# Altium schematic sheet MiniSTM32_2.SchDoc: MIni Device
size A4; DrawnBy: Sean
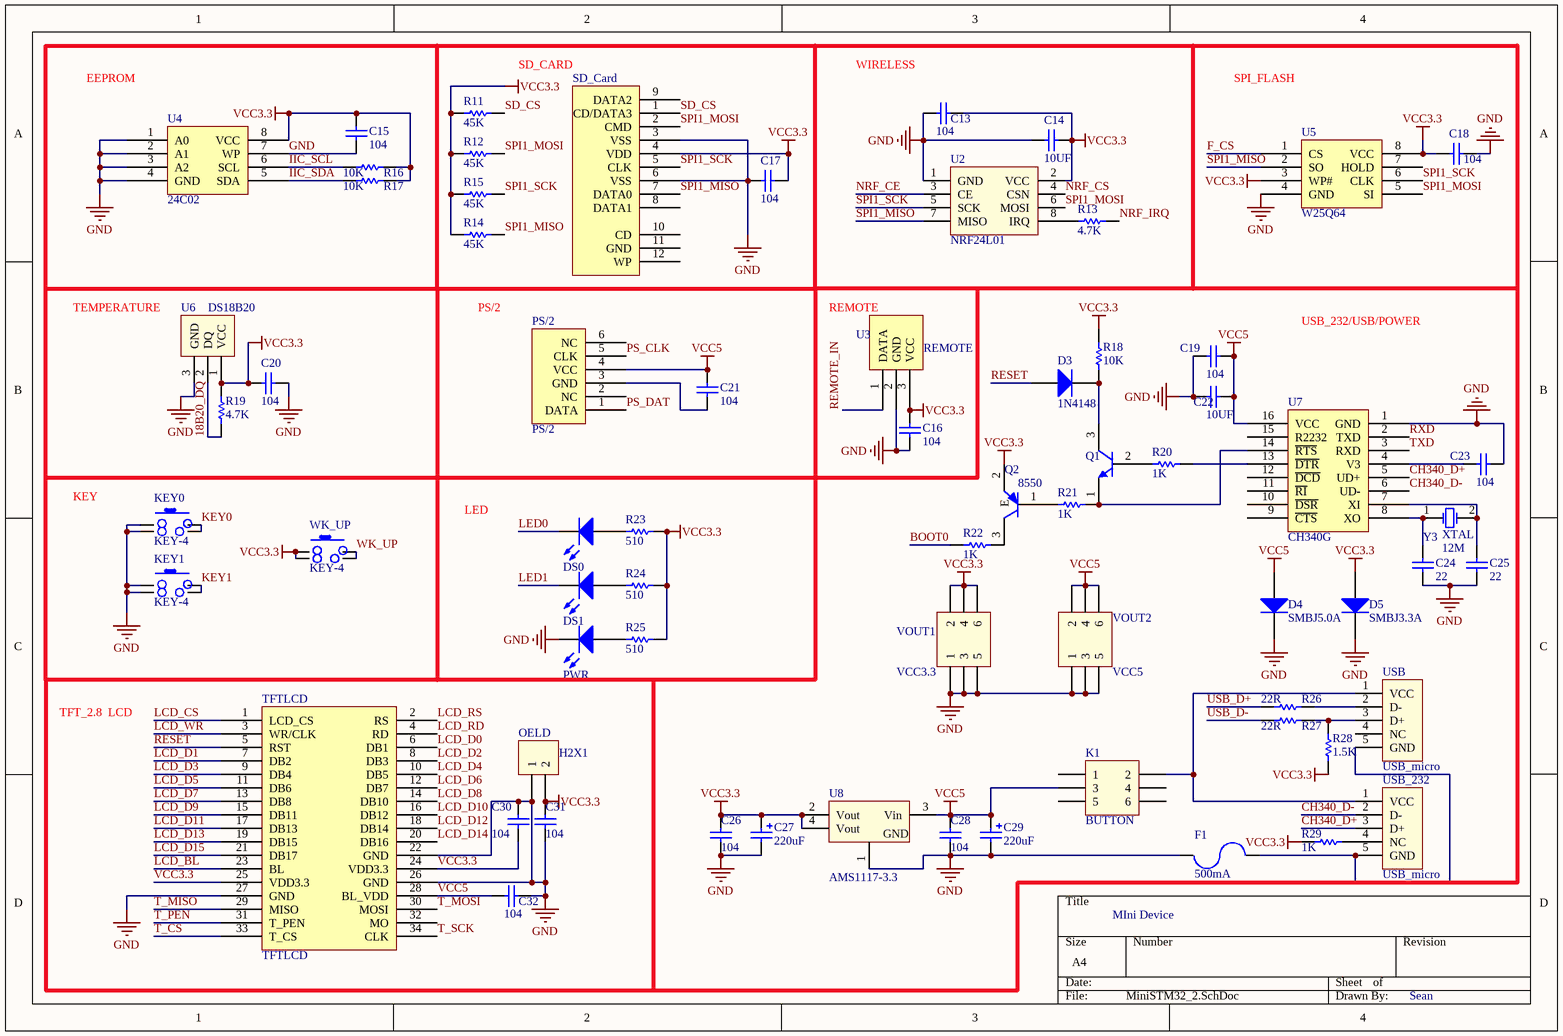
[diagram p0: MiniSTM32_2.SchDoc]

## Parts
C13  Cap  [CAP[0603]]  (value not drawn)
C14  Cap  [CAP[0805]]  (value not drawn)
C15  Cap  [CAP[0603]]  (value not drawn)
C16  Cap  [CAP[0603]]  (value not drawn)
C17  Cap  [CAP[0603]]  (value not drawn)
C18  Cap  [CAP[0603]]  (value not drawn)
C19  Cap  [CAP[0603]]  (value not drawn)
C20  Cap  [CAP[0603]]  (value not drawn)
C21  Cap  [CAP[0603]]  (value not drawn)
C22  Cap  [CAP[1206]]  (value not drawn)
C23  Cap  [CAP[0603]]  (value not drawn)
C24  Cap  [CAP[0805]]  (value not drawn)
C25  Cap  [CAP[0805]]  (value not drawn)
C26  Cap  [CAP[0603]]  (value not drawn)
C27  Cap Pol  [R_6_3_h_7_7]  (value not drawn)
C28  Cap  [CAP[0603]]  (value not drawn)
C29  Cap Pol  [R_6_3_h_7_7]  (value not drawn)
C30  Cap  [CAP[0603]]  (value not drawn)
C31  Cap  [CAP[0603]]  (value not drawn)
C32  Cap  [CAP[0603]]  (value not drawn)
D3  1N4148  [1N4733]
D4  SMBJ5.0A  [1N4733]
D5  SMBJ3.3A  [1N4733]
DS0  LED  [LED[0805]]  (value not drawn)
DS1  LED  [LED[0805]]  (value not drawn)
F1  500mA  [PTC[1206]]
K1  BUTTON  [KEY-6]
KEY0  KEY-4  [KEY-4(DIP)]
KEY1  KEY-4  [KEY-4(DIP)]
OELD  H2X1  [H2.54-1X2(IN)]
PS/2  PS/2  [PS/2]
PWR  LED  [LED[0805]]  (value not drawn)
Q1  9013/8050  [SOT23A]  (value not drawn)
Q2  8550  [SOT23A]
R11  Res  [RES[0603]]  (value not drawn)
R12  Res  [RES[0603]]  (value not drawn)
R13  Res  [RES[0603]]  (value not drawn)
R14  Res  [RES[0603]]  (value not drawn)
R15  Res  [RES[0603]]  (value not drawn)
R16  Res  [RES[0603]]  (value not drawn)
R17  Res  [RES[0603]]  (value not drawn)
R18  Res  [RES[0603]]  (value not drawn)
R19  Res  [RES[0603]]  (value not drawn)
R20  Res  [RES[0603]]  (value not drawn)
R21  Res  [RES[0603]]  (value not drawn)
R22  Res  [RES[0603]]  (value not drawn)
R23  Res  [RES[0603]]  (value not drawn)
R24  Res  [RES[0603]]  (value not drawn)
R25  Res  [RES[0603]]  (value not drawn)
R26  Res  [RES[0603]]  (value not drawn)
R27  Res  [RES[0603]]  (value not drawn)
R28  Res  [RES[0603]]  (value not drawn)
R29  Res  [RES[0603]]  (value not drawn)
SD_Card  SD_Card  [SD_Card]
TFTLCD  TFTLCD  [TFTLCD_2_8]
U2  NRF24L01  [NRF24L01]
U3  REMOTE  [REMOTE]
U4  24C02  [SO-8]
U5  W25Q64  [SO-8]
U6  DS18B20  [H2.54-1X3(RM)]
U7  CH340G  [SO-16]
U8  AMS1117-3.3  [SOT-223(AMS1117-3.3)]
USB  USB_micro  [USB B mini 5pin]
USB_232  USB_micro  [USB B mini 5pin]
VOUT1  VCC3.3  [H2.54-2X3]
VOUT2  VCC5  [H2.54-2X3]
WK_UP  KEY-4  [KEY-4(DIP)]
Y3  XTAL  [XTAL]

## Nets
GND: C13.1 C14.1 C15.1 C16.1 C17.1 C18.2 C19.1 C20.2 C22.1 C23.2 C24.1 C25.1 C26.2 C27.2 C28.2 C29.2 C30.2 C31.1 C32.1 D4.2(K) D5.2(K) F1.1 KEY0.1 KEY0.2 KEY1.1 KEY1.2 OELD.1 PWR.2(K) SD_Card.3(VSS) SD_Card.6(VSS) TFTLCD.22(GND) TFTLCD.26(GND) TFTLCD.27(GND) U2.1(GND) U3.2(GND) U4.1(A0) U4.2(A1) U4.3(A2) U4.4(GND) U4.7(WP) U5.4(GND) U6.3(GND) U7.1(GND) U8.1(GND) VOUT1.1 VOUT1.3 VOUT1.5 VOUT2.1 VOUT2.3 VOUT2.5
VCC3.3: C13.2 C14.2 C15.2 C16.2 C17.2 C18.1 C20.1 C26.1 C27.1 C30.1 C31.2 D5.1(A) OELD.2 Q2.2(E) R11.1 R12.1 R14.1 R15.1 R16.2 R17.2 R18.2 R19.2 R23.2 R24.2 R25.2 R28.1 R29.1 SD_Card.4(VDD) TFTLCD.24(VDD3.3) TFTLCD.25(VDD3.3) U2.2(VCC) U3.3(VCC) U4.8(VCC) U5.3(WP#) U5.8(VCC) U6.1(VCC) U8.2(Vout) U8.4(Vout) VOUT1.2 VOUT1.4 VOUT1.6 WK_UP.1 WK_UP.2
VCC5: C19.2 C21.2 C22.2 C28.1 C29.1 C32.2 D4.1(A) K1.3 PS/2.4(VCC) TFTLCD.28(BL_VDD) U7.16(VCC) U8.3(Vin) VOUT2.2 VOUT2.4 VOUT2.6
18B20_DQ: R19.1 U6.2(DQ)
BOOT0: R22.1
CH340_D+: U7.5(UD+) USB_232.3(D+)
CH340_D-: U7.6(UD-) USB_232.2(D-)
F_CS: U5.1(CS)
IIC_SCL: R16.1 U4.6(SCL)
IIC_SDA: R17.1 U4.5(SDA)
KEY0: KEY0.3 KEY0.4
KEY1: KEY1.3 KEY1.4
LCD_BL: TFTLCD.23(BL)
LCD_CS: TFTLCD.1(LCD_CS)
LCD_D0: TFTLCD.6(DB1)
LCD_D1: TFTLCD.7(DB2)
LCD_D2: TFTLCD.8(DB3)
LCD_D3: TFTLCD.9(DB4)
LCD_D4: TFTLCD.10(DB5)
LCD_D5: TFTLCD.11(DB6)
LCD_D6: TFTLCD.12(DB7)
LCD_D7: TFTLCD.13(DB8)
LCD_D8: TFTLCD.14(DB10)
LCD_D9: TFTLCD.15(DB11)
LCD_D10: TFTLCD.16(DB12)
LCD_D11: TFTLCD.17(DB13)
LCD_D12: TFTLCD.18(DB14)
LCD_D13: TFTLCD.19(DB15)
LCD_D14: TFTLCD.20(DB16)
LCD_D15: TFTLCD.21(DB17)
LCD_RD: TFTLCD.4(RD)
LCD_RS: TFTLCD.2(RS)
LCD_WR: TFTLCD.3(WR/CLK)
LED0: DS0.2(K)
LED1: DS1.2(K)
NRF_CE: U2.3(CE)
NRF_CS: U2.4(CSN)
NRF_IRQ: R13.2
PS_CLK: PS/2.5(CLK)
PS_DAT: PS/2.1(DATA)
REMOTE_IN: U3.1(DATA)
RESET: D3.1 TFTLCD.5(RST)
RXD: U7.2(TXD)
SD_CS: R11.2 SD_Card.1(CD/DATA3)
SPI1_MISO: R14.2 SD_Card.7(DATA0) U2.7(MISO) U5.2(SO)
SPI1_MOSI: R12.2 SD_Card.2(CMD) U2.6(MOSI) U5.5(SI)
SPI1_SCK: R15.2 SD_Card.5(CLK) U2.5(SCK) U5.6(CLK)
T_CS: TFTLCD.33(T_CS)
T_MISO: TFTLCD.29(MISO)
T_MOSI: TFTLCD.30(MOSI)
T_PEN: TFTLCD.31(T_PEN)
T_SCK: TFTLCD.34(CLK)
TXD: U7.3(RXD)
USB_D+: R26.1
USB_D-: R27.1
WK_UP: WK_UP.3 WK_UP.4
NetC21_1: C21.1 PS/2.3(GND)
NetC23_1: C23.1 U7.4(V3)
NetC24_2: C24.2 U7.8(XO) Y3.1(OSC1)
NetC25_2: C25.2 U7.7(XI) Y3.2(OSC2)
NetD3_2: D3.2 Q1.3(C) R18.1
NetDS0_1: DS0.1(A) R23.1
NetDS1_1: DS1.1(A) R24.1
NetF1_2: F1.2 USB.5(GND) USB_232.5(GND)
NetK1_2: K1.2 USB.1(VCC) USB_232.1(VCC)
NetPWR_1: PWR.1(A) R25.1
NetQ1_1: Q1.1(E) R21.2 U7.14(~{RTS})
NetQ1_2: Q1.2(B) R20.1
NetQ2_1: Q2.1(B) R21.1
NetQ2_3: Q2.3(C) R22.2
NetR13_1: R13.1 U2.8(IRQ)
NetR20_2: R20.2 U7.13(~{DTR})
NetR26_2: R26.2 USB.2(D-)
NetR27_2: R27.2 R28.2 USB.3(D+)
NetR29_2: R29.2 USB_232.4(NC)

Not connected (* = marked no-connect by the designer): K1 1 4 5 6; PS/2 2(NC) 6(NC); SD_Card 8(DATA1) 9(DATA2) 10(CD) 11(GND) 12(WP); TFTLCD 32(MO); U5 7(HOLD); U7 9(~{CTS}) 10(~{DSR}) 11(~{RI}) 12(~{DCD}) 15(R2232); USB 4(NC)

## Notes on the sheet
- EEPROM
- (near R11) SD_CARD
- (near C13) WIRELESS
- SPI_FLASH
- TEMPERATURE
- PS/2
- REMOTE
- USB_232/USB/POWER
- KEY
- LED
- TFT_2.8  LCD
- (in symbol Cap) 104; 10UF; 22
- (in symbol Cap Pol) 220uF
- (in symbol Res) 10K; 4.7K; 1K; 22R; 1.5K; 510; 45K
- (in symbol XTAL) 12M

## Library data of the parts
D4 D5 = 1N5822
F1 = PTC
K1 VOUT1 VOUT2 = H3X2
Q2 = 9012/8550